# Altium schematic sheet design_4.SchDoc: design
size 414 x 279 mm; Date: 1/25/2021 11:39:22 PM; SheetNumber: 5; Origin: Eagle; GateName_1: G$1; SymbolName_1: A3-L-GUMSTIX; LibraryName: qualified_1; DeviceSetName: A3-L-GUMSTIX; A: A; B: B; C: C; D: D; E: E; F: F; G: G; H: H; 1: 1; 2: 2; 3: 3; 4: 4; 5: 5; Sheet: Sheet:; C:/Gumstix/gumstix-logo-16.bmp: C:/Gumstix/gumstix-logo-16.bmp; Board: Board:
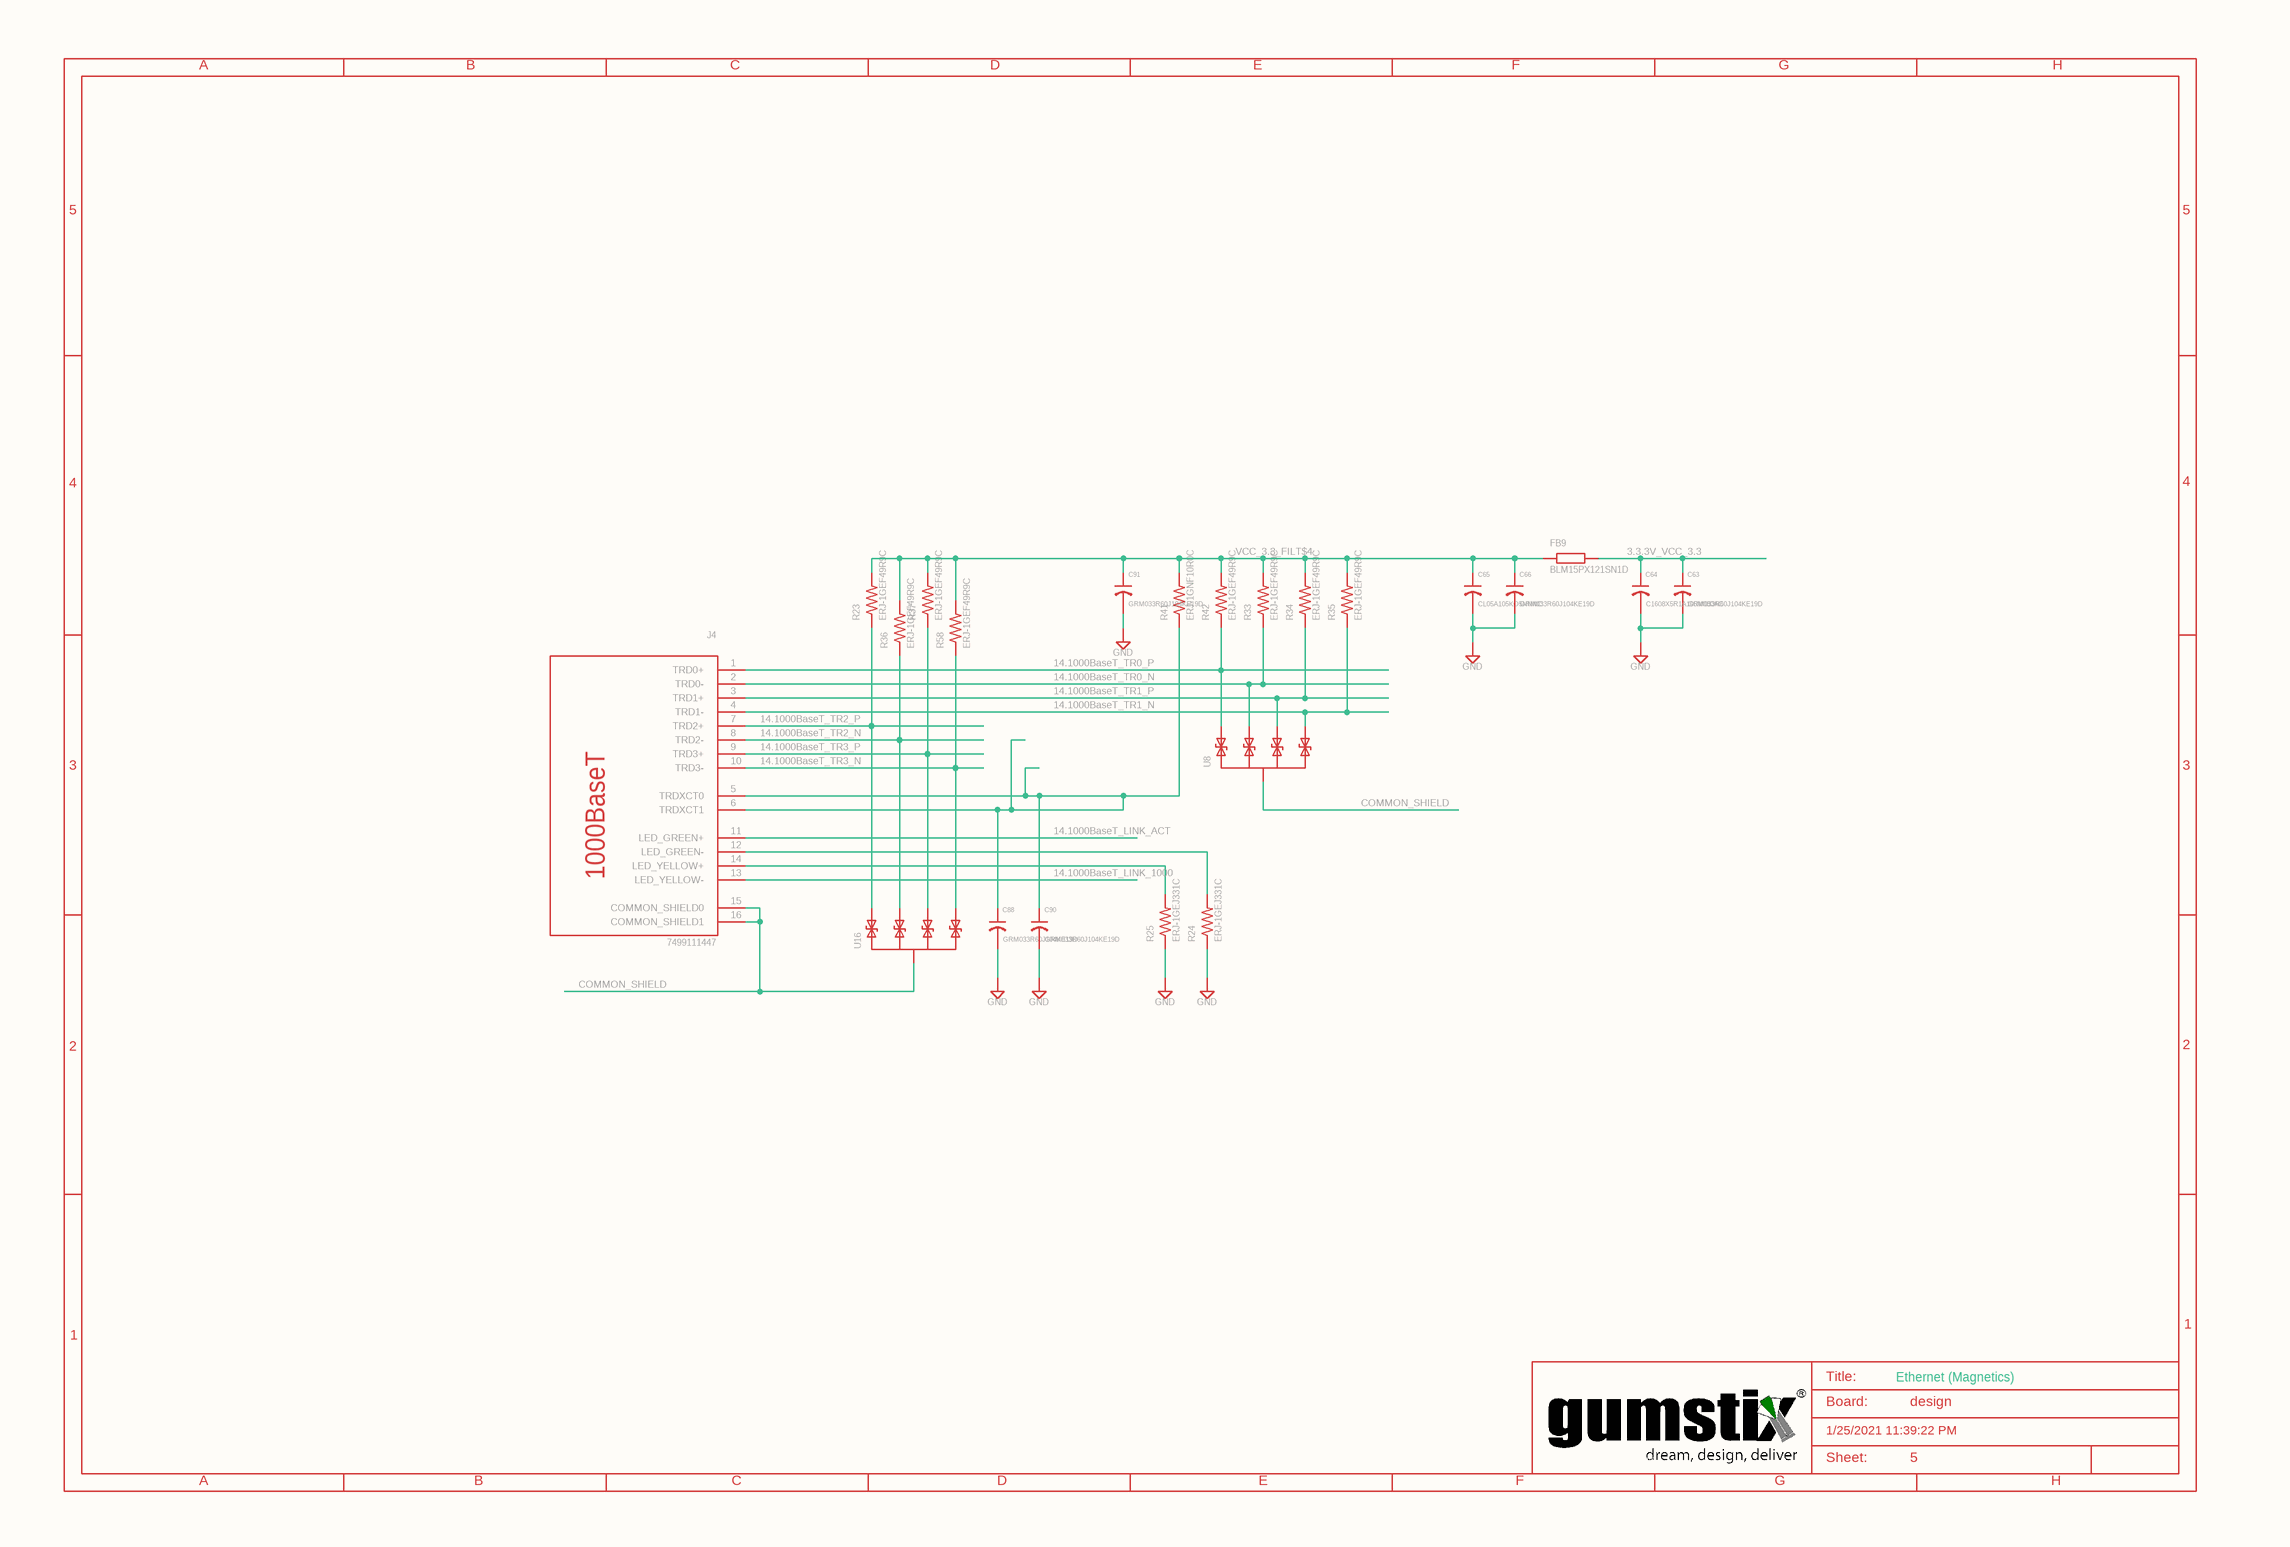
[diagram p0: design_4.SchDoc]

## Parts
C63  GRM033R60J104KE19D  [0201]
C64  C1608X5R1A106M080AC  [0603]
C65  CL05A105KO5NNNC  [0402]
C66  GRM033R60J104KE19D  [0201]
C88  GRM033R60J104KE19D  [0201]
C90  GRM033R60J104KE19D  [0201]
C91  GRM033R60J104KE19D  [0201]
FB9  BLM15PX121SN1D  [0402]
J4  7499111447  [7499111447]
R23  ERJ-1GEF49R9C  [0201]
R24  ERJ-1GEJ331C  [0201]
R25  ERJ-1GEJ331C  [0201]
R33  ERJ-1GEF49R9C  [0201]
R34  ERJ-1GEF49R9C  [0201]
R35  ERJ-1GEF49R9C  [0201]
R36  ERJ-1GEF49R9C  [0201]
R37  ERJ-1GEF49R9C  [0201]
R41  ERJ-1GNF10R0C  [0201]
R42  ERJ-1GEF49R9C  [0201]
R58  ERJ-1GEF49R9C  [0201]
SUPPLY92  GND
SUPPLY93  GND
SUPPLY94  GND
SUPPLY100  GND
SUPPLY101  GND
SUPPLY102  GND
SUPPLY107  GND
U8  TPD4E02B04DQAR  [UFDFN-10]  (value not drawn)
U16  TPD4E02B04DQAR  [UFDFN-10]  (value not drawn)

## Nets
3.3.3V_VCC_3.3: C63.1 C64.1 FB9.2
14.1000BaseT_LINK_1000: J4.13(LED_YELLOW-)
14.1000BaseT_LINK_ACT: J4.11(LED_GREEN+)
14.1000BaseT_TR0_N: J4.2(TRD0-) R33.1 U8.2_9(P2)
14.1000BaseT_TR0_P: J4.1(TRD0+) R42.1 U8.1_10(P1)
14.1000BaseT_TR1_N: J4.4(TRD1-) R35.1 U8.5_6(P4)
14.1000BaseT_TR1_P: J4.3(TRD1+) R34.1 U8.4_7(P3)
14.1000BaseT_TR2_N: J4.8(TRD2-) R36.1 U16.2_9(P2)
14.1000BaseT_TR2_P: J4.7(TRD2+) R23.1 U16.1_10(P1)
14.1000BaseT_TR3_N: J4.10(TRD3-) R58.1 U16.5_6(P4)
14.1000BaseT_TR3_P: J4.9(TRD3+) R37.1 U16.4_7(P3)
COMMON_SHIELD: J4.15(COMMON_SHIELD0) J4.16(COMMON_SHIELD1) U8.3_8(SHIELD) U16.3_8(SHIELD)
VCC_3.3_FILT$4: C65.1 C66.1 C91.1 FB9.1 R23.2 R33.2 R34.2 R35.2 R36.2 R37.2 R41.2 R42.2 R58.2
NetC63_2: C63.2 C64.2 SUPPLY93.?1(GND)
NetC65_2: C65.2 C66.2 SUPPLY92.?1(GND)
NetC88_1: C88.1 C90.1 J4.5(TRDXCT0) J4.6(TRDXCT1) R41.1
NetC88_2: C88.2 SUPPLY94.?1(GND)
NetC90_2: C90.2 SUPPLY100.?1(GND)
NetC91_2: C91.2 SUPPLY102.?1(GND)
NetJ4_12: J4.12(LED_GREEN-) R24.2
NetJ4_14: J4.14(LED_YELLOW+) R25.2
NetR24_1: R24.1 SUPPLY101.?1(GND)
NetR25_1: R25.1 SUPPLY107.?1(GND)

## Notes on the sheet
- A
- B
- C
- D
- E
- F
- G
- H
- 5
- 4
- 3
- 2
- 1
- Title:
- Board:
- Ethernet (Magnetics)
- design
- C:/Gumstix/gumstix-logo-16.bmp
- 1/25/2021 11:39:22 PM
- Sheet:

## Library data of the parts
C63 C66 C88 C90 C91 = GRM033R60J104KE19D: GateName_1: G$1; SymbolName_1: C-US; LibraryName: qualified_1@eagle_src_repo_635c6cefb04d901352cb5cab0982b753f09e9156; DeviceSetName: GRM033R60J104KE19D; HEIGHT: 0.25
C64 = C1608X5R1A106M080AC: GateName_1: G$1; SymbolName_1: C-US; LibraryName: qualified_1@eagle_src_repo_635c6cefb04d901352cb5cab0982b753f09e9156; DeviceSetName: C1608X5R1A106M080AC; HEIGHT: 0.5
C65 = CL05A105KO5NNNC: GateName_1: G$1; SymbolName_1: C-US; LibraryName: qualified_1@eagle_src_repo_635c6cefb04d901352cb5cab0982b753f09e9156; DeviceSetName: CL05A105KO5NNNC; HEIGHT: 0.35
FB9 = BLM15PX121SN1D: GateName_1: G$1; SymbolName_1: FB; LibraryName: qualified_1@eagle_src_repo_635c6cefb04d901352cb5cab0982b753f09e9156; DeviceSetName: BLM15PX121SN1D; HEIGHT: 0.35
J4 = 7499111447: 1000BASE-T Ethernet Jack; GateName_1: G$1; SymbolName_1: 1000BASET; LibraryName: qualified_1; DeviceSetName: 7499111447; 1000BaseT: 1000BaseT
R23 R33-R37 R42 R58 = ERJ-1GEF49R9C: GateName_1: G$1; SymbolName_1: R-US; LibraryName: qualified_1@eagle_src_repo_635c6cefb04d901352cb5cab0982b753f09e9156; DeviceSetName: ERJ-1GEF49R9C; HEIGHT: 0.25
R24 R25 = ERJ-1GEJ331C: GateName_1: G$1; SymbolName_1: R-US; LibraryName: qualified_1@eagle_src_repo_635c6cefb04d901352cb5cab0982b753f09e9156; DeviceSetName: ERJ-1GEJ331C; HEIGHT: 0.25
R41 = ERJ-1GNF10R0C: GateName_1: G$1; SymbolName_1: R-US; LibraryName: qualified_1@eagle_src_repo_635c6cefb04d901352cb5cab0982b753f09e9156; DeviceSetName: ERJ-1GNF10R0C; HEIGHT: 0.25
SUPPLY92 SUPPLY93 = GND: SUPPLY SYMBOL; GateName_1: GND; SymbolName_1: GND; LibraryName: supply2; DeviceSetName: GND
SUPPLY94 SUPPLY100-SUPPLY102 SUPPLY107 = GND: SUPPLY SYMBOL; SymbolName_1: GND-2; GateName_1: GND; LibraryName: qualified_1; DeviceSetName: GND
U8 U16 = TPD4E02B04DQAR: TPD4E02B04 4-Channel ESD Protection Diode for USB Type-C and HDMI 2.0    http://www.ti.com/lit/ds/symlink/tpd4e02b04.pdf; GateName_1: G1; SymbolName_1: ESD-DIODE-4; LibraryName: qualified_1; DeviceSetName: TPD4E02B04DQAR